# Altium schematic sheet Sheet1.SchDoc
size A3
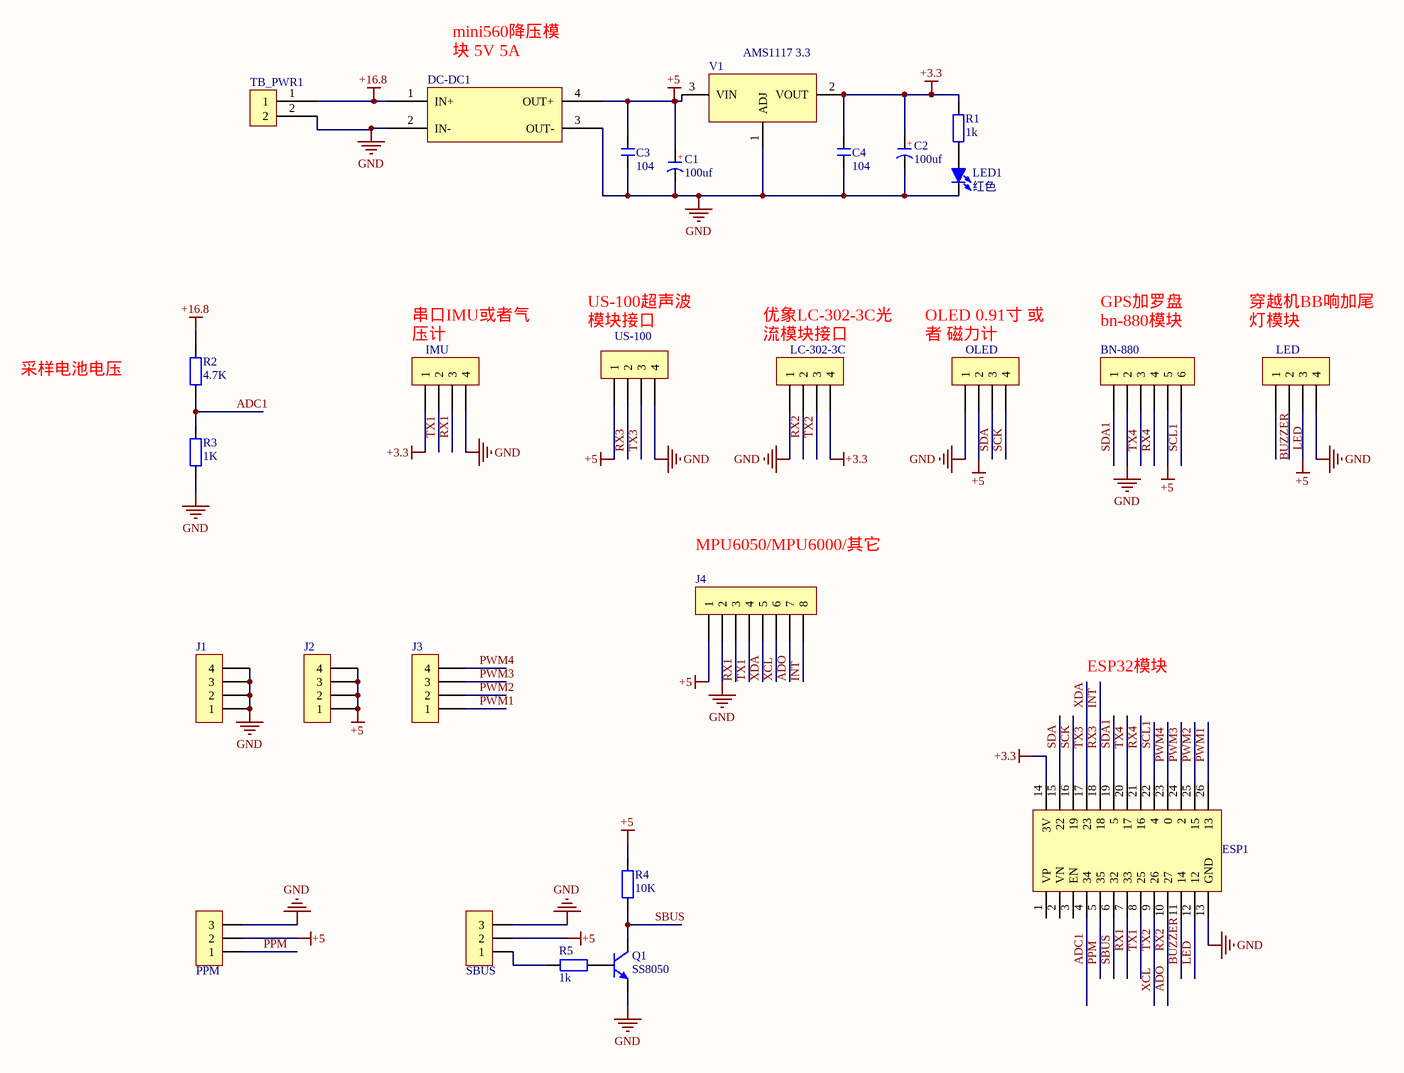
[diagram p0: Sheet1.SchDoc]

## Parts
BN-880  Pin HDR1X6  [SH1.0 S-W-6P]  (value not drawn)
C1  100uf  [C7343-D]
C2  100uf  [C7343-D]
C3  104  [C 0603_M]
C4  104  [C 0603_M]
DC-DC1  DC-DC  [DC-DC]  (value not drawn)
ESP1  ESP32  [esp32]  (value not drawn)
IMU  Female HDR1X4  [SH1.0 S-W-4P]  (value not drawn)
J1  Pin HDR1X4  [Pin HDR1X4/2.54mm-S]  (value not drawn)
J2  Pin HDR1X4  [Pin HDR1X4/2.54mm-S]  (value not drawn)
J3  Pin HDR1X4  [Pin HDR1X4/2.54mm-S]  (value not drawn)
J4  Female HDR1X8  [Fe-HDR1X8/2.54-S]  (value not drawn)
LC-302-3C  Female HDR1X4  [SH1.0 S-W-4P]  (value not drawn)
LED  Female HDR1X4  [SH1.0 S-W-4P]  (value not drawn)
LED1  红色  [LED 0603R]
OLED  Female HDR1X4  [SH1.0 S-W-4P]  (value not drawn)
PPM  HDR-1X3  [Pin HDR1X3/2.54mm-S]  (value not drawn)
Q1  SS8050  [SOT23-3L]
R1  1k  [R 0603_M]
R2  4.7K  [R 0603_M]
R3  1K  [R 0603_M]
R4  10K  [R 0603_M]
R5  1k  [R 0603_M]
SBUS  HDR-1X3  [Pin HDR1X3/2.54mm-S]  (value not drawn)
TB_PWR1  TB002-500-02BE  [XH2.54-LI-2P]  (value not drawn)
US-100  Female HDR1X4  [SH1.0 S-W-4P]  (value not drawn)
V1  AMS1117 3.3  [SOT223]

## Nets
+3.3: C2.1(A) C4.2 ESP1.14(3V) IMU.1 LC-302-3C.4 R1.2 V1.2(VOUT)
+5: BN-880.5 C1.1(A) C3.2 DC-DC1.4(OUT+) J2.1 J2.2 J2.3 J2.4 J4.1 LED.3 OLED.2 PPM.2 R4.1 SBUS.2 US-100.1 V1.3(VIN)
+16.8: DC-DC1.1(IN+) R2.2 TB_PWR1.1
GND: BN-880.2 C1.2(K) C2.2(K) C3.1 C4.1 DC-DC1.2(IN-) DC-DC1.3(OUT-) ESP1.13(GND) IMU.4 J1.1 J1.2 J1.3 J1.4 J4.2 LC-302-3C.1 LED.4 LED1.2(K) OLED.1 PPM.3 Q1.2(E) R3.1 SBUS.3 TB_PWR1.2 US-100.4 V1.1(ADJ)
ADC1: ESP1.4(34) R2.1 R3.2
ADO: ESP1.10(27) J4.7 LC-302-3C.2  [also labelled RX2]
BUZZER: ESP1.11(14) LED.1
INT: ESP1.18 J4.8 US-100.2  [also labelled RX3]
LED: ESP1.12 LED.2
PPM: ESP1.5(35) PPM.1
PWM1: ESP1.26(13) J3.1
PWM2: ESP1.25(15) J3.2
PWM3: ESP1.24(2) J3.3
PWM4: ESP1.23(0) J3.4
RX1: ESP1.7(33) IMU.3 J4.3
RX4: BN-880.4 ESP1.21(16)
SBUS: ESP1.6(32) Q1.3(C) R4.2
SCK: ESP1.16(19) OLED.4
SCL1: BN-880.6 ESP1.22(4)
SDA: ESP1.15(22) OLED.3
SDA1: BN-880.1 ESP1.19(5)
TX1: ESP1.8(25) IMU.2 J4.4
TX2: ESP1.9(26) J4.6 LC-302-3C.3  [also labelled XCL]
TX3: ESP1.17(23) J4.5 US-100.3  [also labelled XDA]
TX4: BN-880.3 ESP1.20(17)
NetLED1_1: LED1.1(A) R1.1
NetQ1_1: Q1.1(B) R5.1
NetR5_2: R5.2 SBUS.1

Not connected (* = marked no-connect by the designer): ESP1 1(VP) 2(VN) 3(EN)

## Notes on the sheet
- (near DC-DC1) mini560降压模块 5V 5A
- (near IMU) 串口IMU或者气压计
- (near US-100) US-100超声波模块接口
- (near LC-302-3C) 优象LC-302-3C光流模块接口
- (near OLED) OLED 0.91寸 或者 磁力计
- GPS加罗盘 bn-880模块
- 穿越机BB响加尾灯模块
- 采样电池电压
- (near J4) MPU6050/MPU6000/其它
- ESP32模块
- (in symbol C-CD) +

## Library data of the parts
C1 C2 = C-CD: 贴片钽电容; 版权归属: 源创客; BOM名称: 贴片钽电容; 学习资源: www.ooocke.com
C3 C4 = C: 无极性贴片电容; 版权归属: 源创客; 材质: X7R; BOM名称: 无极性贴片电容; 学习资源: www.ooocke.com
LED1 = LED-F234: 方形LED; 版权归属: 源创客; BOM名称: 方形LED; 学习资源: www.ooocke.com
PPM SBUS = Header 3: 3P接插件; 版权归属: 源创客; BOM名称: 3P接插件; 学习资源: www.ooocke.com
Q1 = 8050-SMD: 高频放大-NPN型; 版权归属: 源创客; 属性: 40V 1.5A 1W 100MHZ; BOM名称: 高频放大-NPN型; 学习资源: www.ooocke.com
R1-R5 = R: 贴片电阻; 版权归属: 源创客; BOM名称: 贴片电阻; 学习资源: www.ooocke.com
V1 = LM317: 可调线性稳压芯片; 版权归属: 源创客; BOM名称: 可调线性稳压芯片; 学习资源: www.ooocke.com
TB_PWR1 = TB002-500-02BE: Supplier 1: Mouser; Supplier Part Number 1: 490-TB002-500-02BE